# Altium schematic sheet MCU.SchDoc: MCU
size A3; DocumentNumber: MB1165; Revision: C.1; SheetNumber: 2; SheetTotal: 17; Project: STM32469I-EVAL
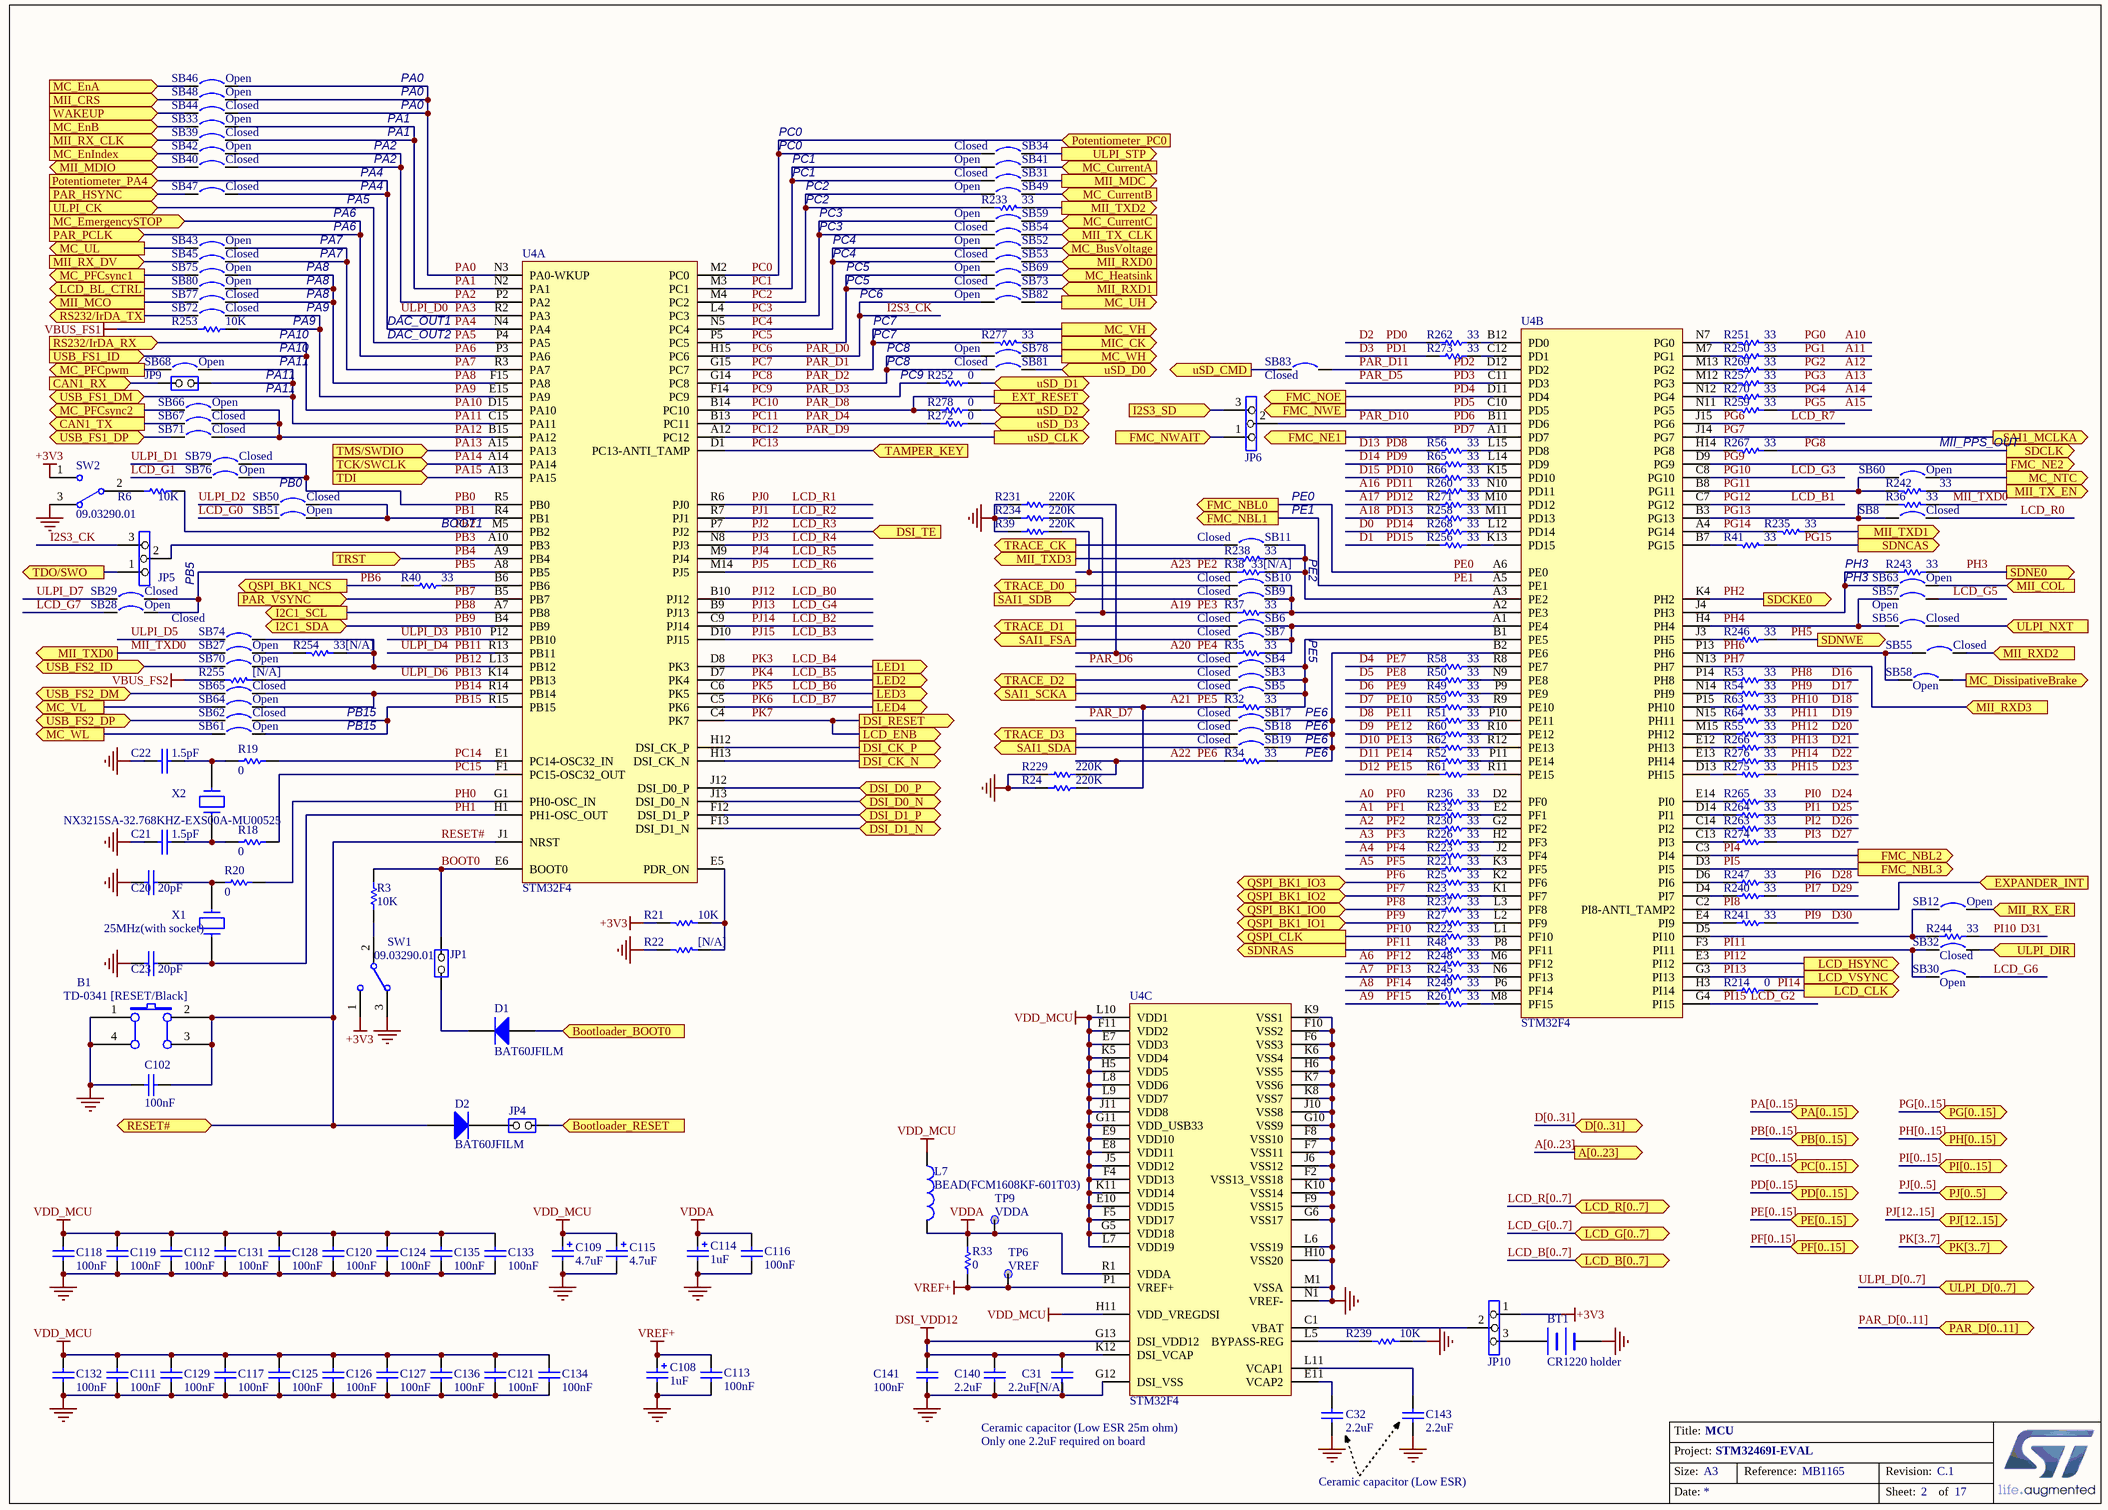
[diagram p0: MCU.SchDoc]

## Parts
B1  TD-0341 [RESET/Black]  [PB10]
BT1  CR1220 holder  [BAT_2SM_CR1220]
C20  20pF  [0603C]
C21  1.5pF  [0603C]
C22  1.5pF  [0603C]
C23  20pF  [0603C]
C31  2.2uF[N/A]  [1206C]
C32  2.2uF  [1206C]
C102  100nF  [0603C]
C108  1uF  [TAN-A]
C109  4.7uF  [TAN-A]
C111  100nF  [0402C]
C112  100nF  [0402C]
C113  100nF  [0402C]
C114  1uF  [TAN-A]
C115  4.7uF  [TAN-A]
C116  100nF  [0402C]
C117  100nF  [0402C]
C118  100nF  [0402C]
C119  100nF  [0402C]
C120  100nF  [0402C]
C121  100nF  [0402C]
C124  100nF  [0402C]
C125  100nF  [0402C]
C126  100nF  [0402C]
C127  100nF  [0402C]
C128  100nF  [0402C]
C129  100nF  [0402C]
C131  100nF  [0402C]
C132  100nF  [0402C]
C133  100nF  [0402C]
C134  100nF  [0402C]
C135  100nF  [0402C]
C136  100nF  [0402C]
C140  2.2uF  [0402C]
C141  100nF  [0402C]
C143  2.2uF  [1206C]
D1  BAT60JFILM  [SOD-323]
D2  BAT60JFILM  [SOD-323]
JP1  (no value)  [SIP2]
JP4  (no value)  [SIP2]
JP5  (no value)  [SIP3]
JP6  (no value)  [SIP3]
JP9  (no value)  [SIP2]
JP10  (no value)  [SIP3]
L7  BEAD(FCM1608KF-601T03)  [0603L]
R3  10K  [0603R]
R6  10K  [0603R]
R18  0  [0603R]
R19  0  [0603R]
R20  0  [0603R]
R21  10K  [0603R]
R22  [N/A]  [0603R]
R23  33  [0402R]
R24  220K  [0603R]
R25  33  [0402R]
R27  33  [0402R]
R32  33  [0402R]
R33  0  [0603R]
R34  33  [0402R]
R35  33  [0402R]
R36  33  [0603R]
R37  33  [0402R]
R38  33[N/A]  [0402R]
R39  220K  [0603R]
R40  33  [0402R]
R41  33  [0402R]
R48  33  [0402R]
R49  33  [0402R]
R50  33  [0402R]
R51  33  [0402R]
R52  33  [0402R]
R53  33  [0402R]
R54  33  [0402R]
R55  33  [0402R]
R56  33  [0402R]
R58  33  [0402R]
R59  33  [0402R]
R60  33  [0402R]
R61  33  [0402R]
R62  33  [0402R]
R63  33  [0402R]
R64  33  [0402R]
R65  33  [0402R]
R66  33  [0402R]
R214  0  [0603R]
R221  33  [0402R]
R222  33  [0402R]
R223  33  [0402R]
R226  33  [0402R]
R229  220K  [0603R]
R230  33  [0402R]
R231  220K  [0603R]
R232  33  [0402R]
R233  33  [0603R]
R234  220K  [0603R]
R235  33  [0603R]
R236  33  [0402R]
R237  33  [0402R]
R238  33  [0603R]
R239  10K  [0603R]
R240  33  [0402R]
R241  33  [0402R]
R242  33  [0603R]
R243  33  [0402R]
R244  33  [0402R]
R245  33  [0402R]
R246  33  [0402R]
R247  33  [0402R]
R248  33  [0402R]
R249  33  [0402R]
R250  33  [0402R]
R251  33  [0402R]
R252  0  [0603R]
R253  10K  [0603R]
R254  33[N/A]  [0603R]
R255  [N/A]  [0603R]
R256  33  [0402R]
R257  33  [0402R]
R258  33  [0402R]
R259  33  [0402R]
R260  33  [0402R]
R261  33  [0402R]
R262  33  [0402R]
R263  33  [0402R]
R264  33  [0402R]
R265  33  [0402R]
R266  33  [0402R]
R267  33  [0402R]
R268  33  [0402R]
R269  33  [0402R]
R270  33  [0402R]
R271  33  [0402R]
R272  0  [0603R]
R273  33  [0402R]
R274  33  [0402R]
R275  33  [0402R]
R276  33  [0402R]
R277  33  [0603R]
R278  0  [0603R]
SB3  Closed  [SB_0603]
SB4  Closed  [SB_0603]
SB5  Closed  [SB_0603]
SB6  Closed  [SB_0603]
SB7  Closed  [SB_0603]
SB8  Closed  [SB_0603]
SB9  Closed  [SB_0603]
SB10  Closed  [SB_0603]
SB11  Closed  [SB_0603]
SB12  Open  [SB_0603]
SB17  Closed  [SB_0603]
SB18  Closed  [SB_0603]
SB19  Closed  [SB_0603]
SB27  Open  [SB_0603]
SB28  Open  [SB_0603]
SB29  Closed  [SB_0603]
SB30  Open  [SB_0603]
SB31  Closed  [SB_0603]
SB32  Closed  [SB_0603]
SB33  Open  [SB_0603]
SB34  Closed  [SB_0603]
SB39  Closed  [SB_0603]
SB40  Closed  [SB_0603]
SB41  Open  [SB_0603]
SB42  Open  [SB_0603]
SB43  Open  [SB_0603]
SB44  Closed  [SB_0603]
SB45  Closed  [SB_0603]
SB46  Open  [SB_0603]
SB47  Closed  [SB_0603]
SB48  Open  [SB_0603]
SB49  Open  [SB_0603]
SB50  Closed  [SB_0603]
SB51  Open  [SB_0603]
SB52  Open  [SB_0603]
SB53  Closed  [SB_0603]
SB54  Closed  [SB_0603]
SB55  Closed  [SB_0603]
SB56  Closed  [SB_0603]
SB57  Open  [SB_0603]
SB58  Open  [SB_0603]
SB59  Open  [SB_0603]
SB60  Open  [SB_0603]
SB61  Open  [SB_0603]
SB62  Closed  [SB_0603]
SB63  Open  [SB_0603]
SB64  Open  [SB_0603]
SB65  Closed  [SB_0603]
SB66  Open  [SB_0603]
SB67  Closed  [SB_0603]
SB68  Open  [SB_0603]
SB69  Open  [SB_0603]
SB70  Open  [SB_0603]
SB71  Closed  [SB_0603]
SB72  Closed  [SB_0603]
SB73  Closed  [SB_0603]
SB74  Closed  [SB_0603]
SB75  Open  [SB_0603]
SB76  Open  [SB_0603]
SB77  Closed  [SB_0603]
SB78  Open  [SB_0603]
SB79  Closed  [SB_0603]
SB80  Open  [SB_0603]
SB81  Closed  [SB_0603]
SB82  Open  [SB_0603]
SB83  Closed  [SB_0603]
SW1  09.03290.01  [SW1_3TH_2R54_10X2R5]
SW2  09.03290.01  [SW1_3TH_2R54_10X2R5]
TP6  VREF  [TP]
TP9  VDDA  [TP]
U4  STM32F4  [BGA216_0R8_13X13_SKT]  (parts A,B,C of 3)
X1  25MHz(with socket)  [XTAL_socket]
X2  NX3215SA-32.768KHZ-EXS00A-MU00525  [XTAL_2SM_3R2X1R5]

## Ports
A[0..23] (out), Bootloader_BOOT0 (in), Bootloader_RESET (in), CAN1_RX (in), CAN1_TX (out), D[0..31] (bidir), DSI_CK_N (out), DSI_CK_P (out), DSI_D0_N (bidir), DSI_D0_P (bidir), DSI_D1_N (bidir), DSI_D1_P (bidir), DSI_RESET (out), DSI_TE (in), EXPANDER_INT (in), EXT_RESET (out), FMC_NBL0 (out), FMC_NBL1 (out), FMC_NBL2 (out), FMC_NBL3 (out), FMC_NE1 (out), FMC_NE2 (out), FMC_NOE (out), FMC_NWAIT (in), FMC_NWE (out), I2C1_SCL (out), I2C1_SDA (bidir), I2S3_SD (in), LCD_B[0..7] (bidir), LCD_BL_CTRL (out), LCD_CLK (out), LCD_ENB (out), LCD_G[0..7] (bidir), LCD_HSYNC (out), LCD_R[0..7] (bidir), LCD_VSYNC (out), LED1 (out), LED2 (out), LED3 (out), LED4 (out), MC_BusVoltage (in), MC_CurrentA (in), MC_CurrentB (in), MC_CurrentC (in), MC_DissipativeBrake (out), MC_EmergencySTOP (in), MC_EnA (in), MC_EnB (in), MC_EnIndex (in), MC_Heatsink (in), MC_NTC (out), MC_PFCpwm (out), MC_PFCsync1 (out), MC_PFCsync2 (out), MC_UH (out), MC_UL (out), MC_VH (out), MC_VL (out), MC_WH (out), MC_WL (out), MIC_CK (out), MII_COL (in), MII_CRS (in), MII_MCO (out), MII_MDC (out), MII_MDIO (bidir), MII_RX_CLK (in), MII_RX_DV (in), MII_RX_ER (in), MII_RXD0 (in), MII_RXD1 (in), MII_RXD2 (in), MII_RXD3 (in), MII_TX_CLK (in), MII_TX_EN (out), MII_TXD0 (out), MII_TXD1 (out), MII_TXD2 (out), MII_TXD3 (out), PA[0..15] (bidir), PAR_D[0..11] (bidir), PAR_HSYNC (in), PAR_PCLK (in), PAR_VSYNC (in), PB[0..15] (bidir), PC[0..15] (bidir), PD[0..15] (bidir), PE[0..15] (bidir), PF[0..15] (bidir), PG[0..15] (bidir), PH[0..15] (bidir), PI[0..15] (bidir), PJ[0..5] (bidir), PJ[12..15] (bidir), PK[3..7] (bidir), Potentiometer_PA4 (in), Potentiometer_PC0 (in), QSPI_BK1_IO0 (bidir), QSPI_BK1_IO1 (bidir), QSPI_BK1_IO2 (bidir), QSPI_BK1_IO3 (bidir), QSPI_BK1_NCS (out), QSPI_CLK (out), RESET# (bidir), RS232/IrDA_RX (in), RS232/IrDA_TX (out), SAI1_FSA (out), SAI1_MCLKA (out), SAI1_SCKA (out), SAI1_SDA (out), SAI1_SDB (in), SDCKE0 (out), SDCLK (out), SDNCAS (out), SDNE0 (out), SDNRAS (out), SDNWE (out), TAMPER_KEY (in), TCK/SWCLK (in), TDI (in), TDO/SWO (out), TMS/SWDIO (in), TRACE_CK (out), TRACE_D0 (out), TRACE_D1 (out), TRACE_D2 (out), TRACE_D3 (out), TRST (in), ULPI_CK (in), ULPI_D[0..7] (bidir), ULPI_DIR (in), ULPI_NXT (in), ULPI_STP (out), USB_FS1_DM (bidir), USB_FS1_DP (bidir), USB_FS1_ID (in), USB_FS2_DM (bidir), USB_FS2_DP (bidir), USB_FS2_ID (bidir), uSD_CLK (out), uSD_CMD (out), uSD_D0 (bidir), uSD_D1 (bidir), uSD_D2 (bidir), uSD_D3 (bidir), WAKEUP (in)

## Nets
+3V3: JP10.1 R21.2 SW1.1 SW2.1
DSI_VDD12: C31.1 C140.1 C141.1 U4.G13(DSI_VDD12) U4.K12(DSI_VCAP)
GND: B1.1(A0) B1.4(A1) BT1.2(-) C20.2 C21.2 C22.2 C23.2 C31.2 C32.2 C102.1 C108.2 C109.2 C111.2 C112.2 C113.1 C114.2 C115.2 C116.1 C117.2 C118.2 C119.2 C120.2 C121.2 C124.2 C125.2 C126.2 C127.2 C128.2 C129.2 C131.2 C132.2 C133.2 C134.2 C135.2 C136.2 C140.2 C141.2 C143.2 R22.2 R24.1 R39.1 R229.1 R231.1 R234.1 R239.1 SW1.3 SW2.3 U4.F2(VSS13_VSS18) U4.F6(VSS3) U4.F7(VSS11) U4.F8(VSS10) U4.F9(VSS15) U4.F10(VSS2) U4.G6(VSS17) U4.G10(VSS9) U4.G12(DSI_VSS) U4.H6(VSS5) U4.H10(VSS20) U4.J6(VSS12) U4.J10(VSS8) U4.K6(VSS4) U4.K7(VSS6) U4.K8(VSS7) U4.K9(VSS1) U4.K10(VSS14) U4.L6(VSS19) U4.M1(VSSA) U4.N1(VREF-)
VBUS_FS1: R253.2
VBUS_FS2: R255.1
VDD_MCU: C109.1 C111.1 C112.1 C115.1 C117.1 C118.1 C119.1 C120.1 C121.1 C124.1 C125.1 C126.1 C127.1 C128.1 C129.1 C131.1 C132.1 C133.1 C134.1 C135.1 C136.1 L7.1 U4.E7(VDD3) U4.E8(VDD11) U4.E9(VDD10) U4.E10(VDD15) U4.F4(VDD13) U4.F5(VDD17) U4.F11(VDD2) U4.G5(VDD18) U4.G11(VDD_USB33) U4.H5(VDD5) U4.H11(VDD_VREGDSI) U4.J5(VDD12) U4.J11(VDD8) U4.K5(VDD4) U4.K11(VDD14) U4.L7(VDD19) U4.L8(VDD6) U4.L9(VDD7) U4.L10(VDD1)
VDDA: C114.1 C116.2 L7.2 R33.1 TP9.1 U4.R1(VDDA)
VREF+: C108.1 C113.2 R33.2 TP6.1 U4.P1(VREF+)
A0: R236.2  [also labelled PF0]
A1: R232.2  [also labelled PF1]
A2: R230.2  [also labelled PF2]
A3: R226.2  [also labelled PF3]
A4: R223.2  [also labelled PF4]
A5: R221.2  [also labelled PF5]
A6: R248.2  [also labelled PF12]
A7: R245.2  [also labelled PF13]
A8: R249.2  [also labelled PF14]
A9: R261.2  [also labelled PF15]
A10: R251.2  [also labelled PG0]
A11: R250.2  [also labelled PG1]
A12: R269.2  [also labelled PG2]
A13: R257.2  [also labelled PG3]
A14: R270.2  [also labelled PG4]
A15: R259.2  [also labelled PG5]
A16: R260.1  [also labelled PD11]
A17: R271.2  [also labelled PD12]
A18: R258.2  [also labelled PD13]
A19: R37.2 R234.2  [also labelled PE3]
A20: R35.2 R231.2  [also labelled PE4]
A21: R24.2 R32.2  [also labelled PE5]
A22: R34.2 R229.2  [also labelled PE6]
A23: R38.2 R39.2  [also labelled PE2]
BOOT0: JP1.2(NO) R3.1 U4.E6(BOOT0)
Bootloader_BOOT0: D1.1(A) ; port Bootloader_BOOT0
Bootloader_RESET: JP4.2(NO) ; port Bootloader_RESET
CAN1_RX: JP9.2(NO) ; port CAN1_RX
CAN1_TX: SB67.1 ; port CAN1_TX
D0: R268.2  [also labelled PD14]
D1: R256.2  [also labelled PD15]
D2: R262.2  [also labelled PD0]
D3: R273.2  [also labelled PD1]
D4: R58.2  [also labelled PE7]
D5: R50.2  [also labelled PE8]
D6: R49.2  [also labelled PE9]
D7: R59.2  [also labelled PE10]
D8: R51.2  [also labelled PE11]
D9: R60.2  [also labelled PE12]
D10: R62.2  [also labelled PE13]
D11: R52.2  [also labelled PE14]
D12: R61.2  [also labelled PE15]
D13: R56.2  [also labelled PD8]
D14: R65.2  [also labelled PD9]
D15: R66.2  [also labelled PD10]
D16: R53.1  [also labelled PH8]
D17: R54.1  [also labelled PH9]
D18: R63.1  [also labelled PH10]
D19: R64.1  [also labelled PH11]
D20: R55.1  [also labelled PH12]
D21: R266.1  [also labelled PH13]
D22: R276.1  [also labelled PH14]
D23: R275.1  [also labelled PH15]
D24: R265.1  [also labelled PI0]
D25: R264.1  [also labelled PI1]
D26: R263.1  [also labelled PI2]
D27: R274.1  [also labelled PI3]
D28: R247.1  [also labelled PI6]
D29: R240.1  [also labelled PI7]
D30: R241.1  [also labelled PI9]
D31: R244.1  [also labelled PI10]
DSI_CK_N: U4.H13(DSI_CK_N) ; port DSI_CK_N
DSI_CK_P: U4.H12(DSI_CK_P) ; port DSI_CK_P
DSI_D0_N: U4.J13(DSI_D0_N) ; port DSI_D0_N
DSI_D0_P: U4.J12(DSI_D0_P) ; port DSI_D0_P
DSI_D1_N: U4.F13(DSI_D1_N) ; port DSI_D1_N
DSI_D1_P: U4.F12(DSI_D1_P) ; port DSI_D1_P
FMC_NWAIT: JP6.1 ; port FMC_NWAIT
I2S3_CK: JP5.3 SB82.1 U4.H15(PC6)  [also labelled PAR_D0, PC6]
I2S3_SD: JP6.3 ; port I2S3_SD
LCD_B0: U4.B10(PJ12)  [also labelled PJ12]
LCD_B1: U4.C7(PG12)  [also labelled PG12]
LCD_B2: U4.C9(PJ14)  [also labelled PJ14]
LCD_B3: U4.D10(PJ15)  [also labelled PJ15]
LCD_B4: U4.D8(PK3) ; port LED1  [also labelled PK3]
LCD_B5: U4.D7(PK4) ; port LED2  [also labelled PK4]
LCD_B6: U4.C6(PK5) ; port LED3  [also labelled PK5]
LCD_B7: U4.C5(PK6) ; port LED4  [also labelled PK6]
LCD_BL_CTRL: SB80.1 ; port LCD_BL_CTRL
LCD_G0: SB51.1
LCD_G1: SB76.1
LCD_G2: U4.G4(PI15)  [also labelled PI15]
LCD_G3: U4.C8(PG10)  [also labelled PG10]
LCD_G4: U4.B9(PJ13)  [also labelled PJ13]
LCD_G5: SB57.2
LCD_G6: SB30.2
LCD_G7: SB28.1
LCD_R0: SB8.2
LCD_R1: U4.R6(PJ0)  [also labelled PJ0]
LCD_R2: U4.R7(PJ1)  [also labelled PJ1]
LCD_R3: U4.P7(PJ2) ; port DSI_TE  [also labelled PJ2]
LCD_R4: U4.N8(PJ3)  [also labelled PJ3]
LCD_R5: U4.M9(PJ4)  [also labelled PJ4]
LCD_R6: U4.M14(PJ5)  [also labelled PJ5]
LCD_R7: U4.J15(PG6)  [also labelled PG6]
MC_BusVoltage: SB52.2 ; port MC_BusVoltage
MC_CurrentA: SB41.2 ; port MC_CurrentA
MC_CurrentB: SB49.2 ; port MC_CurrentB
MC_CurrentC: SB59.2 ; port MC_CurrentC
MC_DissipativeBrake: SB58.2 ; port MC_DissipativeBrake
MC_EnA: SB46.1 ; port MC_EnA
MC_EnB: SB33.1 ; port MC_EnB
MC_EnIndex: SB42.1 ; port MC_EnIndex
MC_Heatsink: SB69.2 ; port MC_Heatsink
MC_NTC: SB60.2 ; port MC_NTC
MC_PFCpwm: SB68.1 ; port MC_PFCpwm
MC_PFCsync1: SB75.1 ; port MC_PFCsync1
MC_PFCsync2: SB66.1 ; port MC_PFCsync2
MC_UH: SB82.2 ; port MC_UH
MC_UL: SB43.1 ; port MC_UL
MC_VL: SB64.1 ; port MC_VL
MC_WH: SB78.2 ; port MC_WH
MC_WL: SB61.1 ; port MC_WL
MIC_CK: R277.2 ; port MIC_CK
MII_COL: SB63.2 ; port MII_COL
MII_CRS: SB48.1 ; port MII_CRS
MII_MCO: SB77.1 ; port MII_MCO
MII_MDC: SB31.2 ; port MII_MDC
MII_MDIO: SB40.1 ; port MII_MDIO
MII_RX_CLK: SB39.1 ; port MII_RX_CLK
MII_RX_DV: SB45.1 ; port MII_RX_DV
MII_RX_ER: SB12.2 ; port MII_RX_ER
MII_RXD0: SB53.2 ; port MII_RXD0
MII_RXD1: SB73.2 ; port MII_RXD1
MII_RXD2: SB55.2 ; port MII_RXD2
MII_TX_CLK: SB54.2 ; port MII_TX_CLK
MII_TX_EN: R242.2 ; port MII_TX_EN
MII_TXD0: R36.2 SB27.1 ; port MII_TXD0
MII_TXD1: R235.2 ; port MII_TXD1
MII_TXD2: R233.2 ; port MII_TXD2
MII_TXD3: R238.1 ; port MII_TXD3
PA0: SB44.2 SB46.2 SB48.2 U4.N3(PA0-WKUP)
PA1: SB33.2 SB39.2 U4.N2(PA1)
PA2: SB40.2 SB42.2 U4.P2(PA2)
PA3: U4.R2(PA3)  [also labelled ULPI_D0]
PA4: SB47.2 U4.N4(PA4) ; port Potentiometer_PA4
PA5: U4.P4(PA5) ; port ULPI_CK
PA6: U4.P3(PA6) ; port MC_EmergencySTOP, port PAR_PCLK
PA7: SB43.2 SB45.2 U4.R3(PA7)
PA8: SB75.2 SB77.2 SB80.2 U4.F15(PA8)
PA9: R253.1 SB72.2 U4.E15(PA9)
PA10: U4.D15(PA10) ; port RS232/IrDA_RX, port USB_FS1_ID
PA11: JP9.1(COMMON) SB68.2 U4.C15(PA11) ; port USB_FS1_DM
PA12: SB66.2 SB67.2 SB71.2 U4.B15(PA12)
PA13: U4.A15(PA13) ; port TMS/SWDIO
PA14: U4.A14(PA14) ; port TCK/SWCLK
PA15: U4.A13(PA15) ; port TDI
PAR_D1: R277.1 U4.G15(PC7) ; port MC_VH  [also labelled PC7]
PAR_D2: SB78.1 SB81.1 U4.G14(PC8)  [also labelled PC8]
PAR_D3: R252.2 U4.F14(PC9)  [also labelled PC9]
PAR_D4: R272.2 U4.B13(PC11)  [also labelled PC11]
PAR_D5: U4.C11(PD3)  [also labelled PD3]
PAR_D6: SB4.1
PAR_D7: SB17.1
PAR_D8: R278.2 U4.B14(PC10) ; port EXT_RESET  [also labelled PC10]
PAR_D9: U4.A12(PC12) ; port uSD_CLK  [also labelled PC12]
PAR_D10: JP6.2 U4.B11(PD6)  [also labelled PD6]
PAR_D11: SB83.2 U4.D12(PD2)  [also labelled PD2]
PAR_HSYNC: SB47.1 ; port PAR_HSYNC
PB0: SB76.2 SB79.2 U4.R5(PB0)
PB1: SB50.2 SB51.2 U4.R4(PB1)
PB2: R6.2 U4.M5(PB2)
PB3: JP5.2 U4.A10(PB3)
PB4: U4.A9(PB4) ; port TRST
PB5: SB28.2 SB29.2 U4.A8(PB5)
PB6: R40.2 ; port QSPI_BK1_NCS
PB7: U4.B5(PB7) ; port PAR_VSYNC
PB8: U4.A7(PB8) ; port I2C1_SCL
PB9: U4.B4(PB9) ; port I2C1_SDA
PB10: U4.P12(PB10)  [also labelled ULPI_D3]
PB11: U4.R13(PB11)  [also labelled ULPI_D4]
PB12: R254.2 SB70.2 SB74.2 U4.L13(PB12)
PB13: R255.2 U4.K14(PB13)  [also labelled ULPI_D6]
PB14: SB64.2 SB65.2 U4.R14(PB14)
PB15: SB61.2 SB62.2 U4.R15(PB15)
PC0: SB34.1 U4.M2(PC0) ; port Potentiometer_PC0
PC1: SB31.1 SB41.1 U4.M3(PC1)
PC2: R233.1 SB49.1 U4.M4(PC2)
PC3: SB54.1 SB59.1 U4.L4(PC3)
PC4: SB52.1 SB53.1 U4.N5(PC4)
PC5: SB69.1 SB73.1 U4.P5(PC5)
PC13: U4.D1(PC13-ANTI_TAMP) ; port TAMPER_KEY
PC14: R19.2 U4.E1(PC14-OSC32_IN)
PC15: R18.2 U4.F1(PC15-OSC32_OUT)
PD4: U4.D11(PD4) ; port FMC_NOE
PD5: U4.C10(PD5) ; port FMC_NWE
PD7: U4.A11(PD7) ; port FMC_NE1
PE0: U4.A6(PE0) ; port FMC_NBL0
PE1: U4.A5(PE1) ; port FMC_NBL1
PF6: R25.2 ; port QSPI_BK1_IO3
PF7: R23.2 ; port QSPI_BK1_IO2
PF8: R237.2 ; port QSPI_BK1_IO0
PF9: R27.2 ; port QSPI_BK1_IO1
PF10: R222.2 ; port QSPI_CLK
PF11: R48.2 ; port SDNRAS
PG7: U4.J14(PG7) ; port SAI1_MCLKA
PG8: R267.2 ; port SDCLK
PG9: U4.D9(PG9) ; port FMC_NE2
PG11: R242.1 SB60.1 U4.B8(PG11)
PG13: R36.1 SB8.1 U4.B3(PG13)
PG14: R235.1 U4.A4(PG14)
PG15: R41.2 ; port SDNCAS
PH0: R20.1 U4.G1(PH0-OSC_IN)
PH1: C23.1 U4.H1(PH1-OSC_OUT) X1.1
PH2: U4.K4(PH2) ; port SDCKE0
PH3: R243.1 ; port SDNE0
PH4: SB56.1 SB57.1 U4.H4(PH4)
PH5: R246.1 ; port SDNWE
PH6: SB55.1 SB58.1 U4.P13(PH6)
PH7: U4.N13(PH7) ; port MII_RXD3
PI4: U4.C3(PI4) ; port FMC_NBL2
PI5: U4.D3(PI5) ; port FMC_NBL3
PI8: U4.C2(PI8-ANTI_TAMP2) ; port EXPANDER_INT
PI11: SB30.1 SB32.1 U4.F3(PI11)
PI12: U4.E3(PI12) ; port LCD_HSYNC
PI13: U4.G3(PI13) ; port LCD_VSYNC
PI14: R214.1 ; port LCD_CLK
PK7: U4.C4(PK7) ; port LCD_ENB, port DSI_RESET
RESET#: B1.2(B0) B1.3(B1) C102.2 D2.1(A) U4.J1(NRST) ; port RESET#
RS232/IrDA_TX: SB72.1 ; port RS232/IrDA_TX
SAI1_FSA: SB7.1 ; port SAI1_FSA
SAI1_SCKA: SB5.1 ; port SAI1_SCKA
SAI1_SDA: SB19.1 ; port SAI1_SDA
SAI1_SDB: SB9.1 ; port SAI1_SDB
TDO/SWO: JP5.1 ; port TDO/SWO
TRACE_CK: SB11.1 ; port TRACE_CK
TRACE_D0: SB10.1 ; port TRACE_D0
TRACE_D1: SB6.1 ; port TRACE_D1
TRACE_D2: SB3.1 ; port TRACE_D2
TRACE_D3: SB18.1 ; port TRACE_D3
ULPI_D1: SB79.1
ULPI_D2: SB50.1
ULPI_D5: SB74.1
ULPI_D7: SB29.1
ULPI_DIR: SB32.2 ; port ULPI_DIR
ULPI_NXT: SB56.2 ; port ULPI_NXT
ULPI_STP: SB34.2 ; port ULPI_STP
USB_FS1_DP: SB71.1 ; port USB_FS1_DP
USB_FS2_DM: SB65.1 ; port USB_FS2_DM
USB_FS2_DP: SB62.1 ; port USB_FS2_DP
USB_FS2_ID: SB70.1 ; port USB_FS2_ID
uSD_CMD: SB83.1 ; port uSD_CMD
uSD_D0: SB81.2 ; port uSD_D0
uSD_D1: R252.1 ; port uSD_D1
uSD_D2: R278.1 ; port uSD_D2
uSD_D3: R272.1 ; port uSD_D3
WAKEUP: SB44.1 ; port WAKEUP
NetBT1_1: BT1.1(+) JP10.3
NetC20_1: C20.1 R20.2 X1.2
NetC21_1: C21.1 R18.1 X2.1
NetC22_1: C22.1 R19.1 X2.2
NetC32_1: C32.1 U4.E11(VCAP2)
NetC143_1: C143.1 U4.L11(VCAP1)
NetD1_2: D1.2(K) JP1.1(COMMON)
NetD2_2: D2.2(K) JP4.1(COMMON)
NetJP10_2: JP10.2 U4.C1(VBAT)
NetR3_2: R3.2 SW1.2
NetR6_1: R6.1 SW2.2
NetR21_1: R21.1 R22.1 U4.E5(PDR_ON)
NetR23_1: R23.1 U4.K1(PF7)
NetR25_1: R25.1 U4.K2(PF6)
NetR27_1: R27.1 U4.L2(PF9)
NetR32_1: R32.1 SB3.2 SB4.2 SB5.2 U4.B1(PE5)
NetR34_1: R34.1 SB17.2 SB18.2 SB19.2 U4.B2(PE6)
NetR35_1: R35.1 SB6.2 SB7.2 U4.A1(PE4)
NetR37_1: R37.1 SB9.2 SB10.2 U4.A2(PE3)
NetR38_1: R38.1 R238.2 SB11.2 U4.A3(PE2)
NetR40_1: R40.1 U4.B6(PB6)
NetR41_1: R41.1 U4.B7(PG15)
NetR48_1: R48.1 U4.P8(PF11)
NetR49_1: R49.1 U4.P9(PE9)
NetR50_1: R50.1 U4.N9(PE8)
NetR51_1: R51.1 U4.P10(PE11)
NetR52_1: R52.1 U4.P11(PE14)
NetR53_2: R53.2 U4.P14(PH8)
NetR54_2: R54.2 U4.N14(PH9)
NetR55_2: R55.2 U4.M15(PH12)
NetR56_1: R56.1 U4.L15(PD8)
NetR58_1: R58.1 U4.R8(PE7)
NetR59_1: R59.1 U4.R9(PE10)
NetR60_1: R60.1 U4.R10(PE12)
NetR61_1: R61.1 U4.R11(PE15)
NetR62_1: R62.1 U4.R12(PE13)
NetR63_2: R63.2 U4.P15(PH10)
NetR64_2: R64.2 U4.N15(PH11)
NetR65_1: R65.1 U4.L14(PD9)
NetR66_1: R66.1 U4.K15(PD10)
NetR214_2: R214.2 U4.H3(PI14)
NetR221_1: R221.1 U4.K3(PF5)
NetR222_1: R222.1 U4.L1(PF10)
NetR223_1: R223.1 U4.J2(PF4)
NetR226_1: R226.1 U4.H2(PF3)
NetR230_1: R230.1 U4.G2(PF2)
NetR232_1: R232.1 U4.E2(PF1)
NetR236_1: R236.1 U4.D2(PF0)
NetR237_1: R237.1 U4.L3(PF8)
NetR239_2: R239.2 U4.L5(BYPASS-REG)
NetR240_2: R240.2 U4.D4(PI7)
NetR241_2: R241.2 U4.E4(PI9)
NetR243_2: R243.2 SB63.1 U4.J4(PH3)
NetR244_2: R244.2 SB12.1 U4.D5(PI10)
NetR245_1: R245.1 U4.N6(PF13)
NetR246_2: R246.2 U4.J3(PH5)
NetR247_2: R247.2 U4.D6(PI6)
NetR248_1: R248.1 U4.M6(PF12)
NetR249_1: R249.1 U4.P6(PF14)
NetR250_1: R250.1 U4.M7(PG1)
NetR251_1: R251.1 U4.N7(PG0)
NetR254_1: R254.1 SB27.2
NetR256_1: R256.1 U4.K13(PD15)
NetR257_1: R257.1 U4.M12(PG3)
NetR258_1: R258.1 U4.M11(PD13)
NetR259_1: R259.1 U4.N11(PG5)
NetR260_2: R260.2 U4.N10(PD11)
NetR261_1: R261.1 U4.M8(PF15)
NetR262_1: R262.1 U4.B12(PD0)
NetR263_2: R263.2 U4.C14(PI2)
NetR264_2: R264.2 U4.D14(PI1)
NetR265_2: R265.2 U4.E14(PI0)
NetR266_2: R266.2 U4.E12(PH13)
NetR267_1: R267.1 U4.H14(PG8)
NetR268_1: R268.1 U4.L12(PD14)
NetR269_1: R269.1 U4.M13(PG2)
NetR270_1: R270.1 U4.N12(PG4)
NetR271_1: R271.1 U4.M10(PD12)
NetR273_1: R273.1 U4.C12(PD1)
NetR274_2: R274.2 U4.C13(PI3)
NetR275_2: R275.2 U4.D13(PH15)
NetR276_2: R276.2 U4.E13(PH14)

## Buses and harness runs
bus A[0..23] = port A[0..23]
bus D[0..31] = port D[0..31]
bus LCD_B[0..7] = port LCD_B[0..7]
bus LCD_G[0..7] = port LCD_G[0..7]
bus LCD_R[0..7] = port LCD_R[0..7]
bus PA[0..15] = port PA[0..15]
bus PAR_D[0..11] = port PAR_D[0..11]
bus PB[0..15] = port PB[0..15]
bus PC[0..15] = port PC[0..15]
bus PD[0..15] = port PD[0..15]
bus PE[0..15] = port PE[0..15]
bus PF[0..15] = port PF[0..15]
bus PG[0..15] = port PG[0..15]
bus PH[0..15] = port PH[0..15]
bus PI[0..15] = port PI[0..15]
bus PJ[0..5] = port PJ[0..5]
bus PJ[12..15] = port PJ[12..15]
bus PK[3..7] = port PK[3..7]
bus ULPI_D[0..7] = port ULPI_D[0..7]

## Notes on the sheet
- PA0
- PA4
- PA2
- PA1
- PC0
- PC1
- PA7
- PA6
- PA5
- PC2
- PC3
- PC4
- PA8
- PA9
- PC5
- PC6
- PA11
- PA10
- DAC_OUT1
- DAC_OUT2
- PC7
- PC8
- PC9
- MII_PPS_OUT
- (near SB50) PB0
- PE0
- PE1
- PB5
- BOOT1
- PE2
- PH3
- PE5
- PB15
- PE6
- Ceramic capacitor (Low ESR 25m ohm)
- Only one 2.2uF required on board
- Ceramic capacitor (Low ESR)
- Title:
- Project:
- Size:
- Date:
- A3
- Reference:
- Sheet:
- Revision:
- of

## Library data of the parts
B1 = SW PUSHBUTTON: SE PUSHBUTTON
BT1 = BATTERY
C20-C23 C111 C112 C117-C121 C124-C129 C131-C136 C141 = CAP: Capacitor
  C111 C112 C117-C121 C124-C129 C131-C136 C141: Published: 8-Jun-2000; Revision: July-2002: Re-released for DXP Platform.; Publisher: Altium Limited; Value: 100nF
C31 C32 C113 C116 C143 = Cap: Capacitor; Value: 10nF; Published: 8-Jun-2000; Revision: July-2002: Re-released for DXP Platform.; Publisher: Altium Limited
C102 = CAP: Capacitor; Value: 100pF; Published: 8-Jun-2000; Revision: July-2002: Re-released for DXP Platform.; Publisher: Altium Limited
C108 C114 = Cap Pol1: Polarized Capacitor (Radial); Value: 10uF; Published: 8-Jun-2000; Revision: July-2002: Re-released for DXP Platform.; Publisher: Altium Limited
C109 C115 = Cap Pol1: Polarized Capacitor (Radial); Value: 47uF; Published: 8-Jun-2000; Revision: July-2002: Re-released for DXP Platform.; Publisher: Altium Limited
C140 = CAP: Capacitor; Value: 100nF; Published: 8-Jun-2000; Revision: July-2002: Re-released for DXP Platform.; Publisher: Altium Limited
D1 D2 = Diode: Default Diode; Code - JEDEC: DO-214-AB; Published: 8-Jun-2000; Revision: July-2002: Re-released for DXP Platform.; Publisher: Altium Limited
JP1 JP4 JP9 = JP2
JP5 JP6 JP10 = Jumper3
L7 = Inductor: Value: 100uH; Published: 8-Jun-2000; Revision: July-2002: Re-released for DXP Platform.; Publisher: Altium Limited
R3 R24 R39 R229 R231 R234 R253 = res1: Resistor; Value: 1K; Published: 8-Jun-2000; Revision: July-2002: Re-released for DXP Platform.; Publisher: Altium Limited
R6 R18-R23 R25 R27 R32-R38 R40 R41 R48-R56 R58-R66 R214 R221-R223 R226 R230 R232 R233 R235-R252 R254-R278 = Res1: Resistor; Value: 1K; Published: 8-Jun-2000; Revision: July-2002: Re-released for DXP Platform.; Publisher: Altium Limited
SB3-SB11 SB17-SB19 SB29 SB31 SB32 SB34 SB39 SB40 SB44 SB45 SB47 SB50 SB53-SB56 SB62 SB65 SB67 SB71-SB74 SB77 SB79 SB81 SB83 = Circuit Breaker_close: Circuit Breaker; Published: 24-Mar-1999; Revision: July-2002: Re-released for DXP Platform.; Publisher: Altium Limited
SB12 SB27 SB28 SB30 SB33 SB41-SB43 SB46 SB48 SB49 SB51 SB52 SB57-SB61 SB63 SB64 SB66 SB68-SB70 SB75 SB76 SB78 SB80 SB82 = Circuit Breaker: Published: 24-Mar-1999; Revision: July-2002: Re-released for DXP Platform.; Publisher: Altium Limited
SW1 SW2 = SW-SPDT: SPDT Subminiature Toggle Switch, Right Angle Mounting, Vertical Actuation; Revision 1: Jul-2002: Re-released for DXP Platform.; Revision 2: 17-Dec-2003: Schematic revised, PCB Footprint replaced.; Published: 24-Mar-1999; Datasheet: Latest Revision: 05-Dec-2000; Publisher: Altium Limited
TP6 TP9 = TP
U4 = Manta_Dragon_TFBGA216
X1 = CRYSTAL
X2 = CRYSTAL_32K: Crystal